# Altium schematic sheet 3EWL1-200001_01.SchDoc: WASSA_Lantern
size A4; Engineer: cronos; Revision: 6A1.0; SheetNumber: 1; SheetTotal: 5
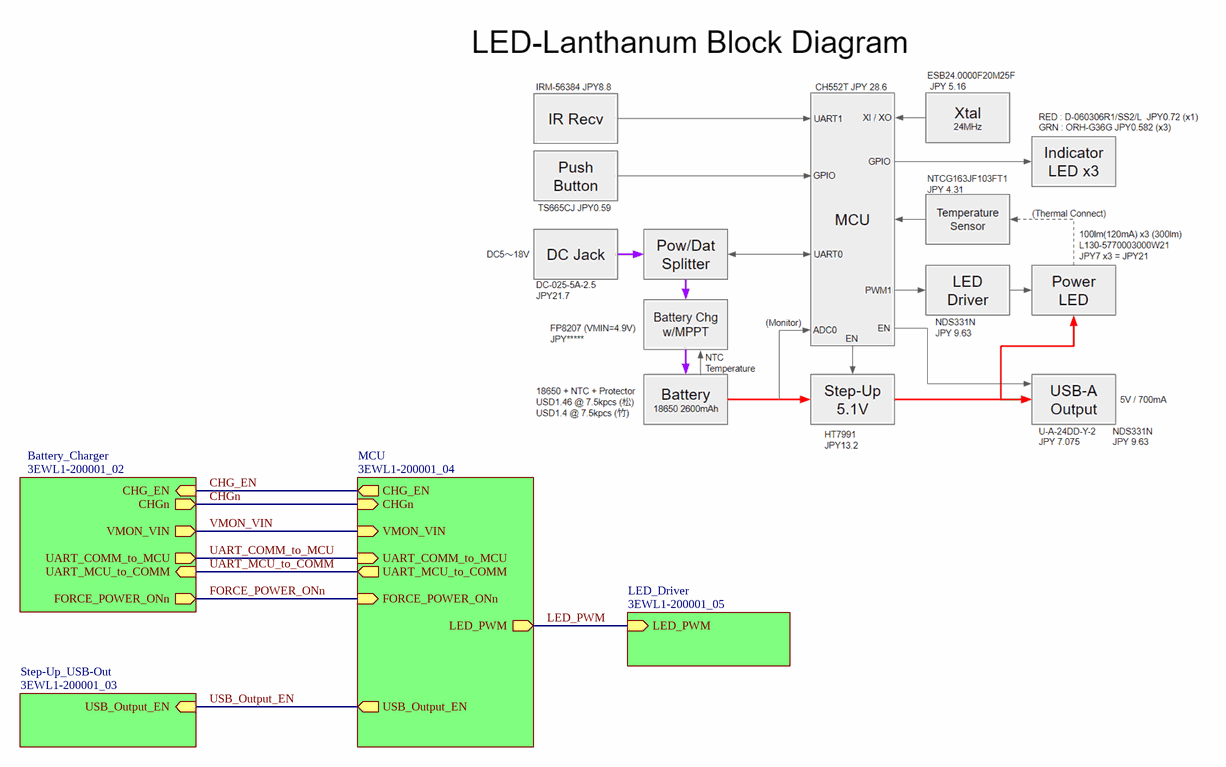
[diagram p0: 3EWL1-200001_01.SchDoc]

## Sub-sheets
Battery_Charger = 3EWL1-200001_02: CHG_EN (in), VMON_VIN (out), CHGn (out), UART_COMM_to_MCU (out), UART_MCU_to_COMM (in), FORCE_POWER_ONn (out)
LED_Driver = 3EWL1-200001_05: LED_PWM (in)
MCU = 3EWL1-200001_04: USB_Output_EN (out), FORCE_POWER_ONn (in), UART_MCU_to_COMM (out), VMON_VIN (in), CHGn (in), CHG_EN (out), LED_PWM (out), UART_COMM_to_MCU (in)
Step-Up_USB-Out = 3EWL1-200001_03: USB_Output_EN (in)

## Nets
CHG_EN: sheet Battery_Charger/CHG_EN, sheet MCU/CHG_EN
CHGn: sheet Battery_Charger/CHGn, sheet MCU/CHGn
FORCE_POWER_ONn: sheet Battery_Charger/FORCE_POWER_ONn, sheet MCU/FORCE_POWER_ONn
LED_PWM: sheet MCU/LED_PWM, sheet LED_Driver/LED_PWM
UART_COMM_to_MCU: sheet Battery_Charger/UART_COMM_to_MCU, sheet MCU/UART_COMM_to_MCU
UART_MCU_to_COMM: sheet Battery_Charger/UART_MCU_to_COMM, sheet MCU/UART_MCU_to_COMM
USB_Output_EN: sheet Step-Up_USB-Out/USB_Output_EN, sheet MCU/USB_Output_EN
VMON_VIN: sheet Battery_Charger/VMON_VIN, sheet MCU/VMON_VIN

## Notes on the sheet
- Model
- Title
- Rev.
- Size
- Filename
- Comment
- Date
- Design
- A4
- Sheet          of